# EAGLE design TDA8920+V3.0 (EAGLE 7.5.0)

## Sheet 1 of 4
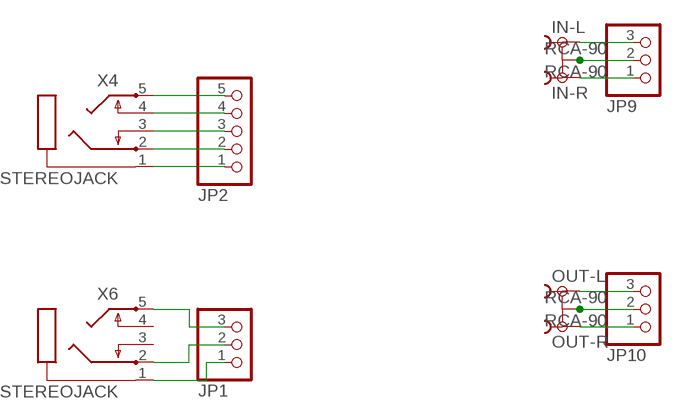
[diagram p0: schematic, sheet 1]

### Parts
IN-L  RCA-90  [RCA-90]
IN-R  RCA-90  [RCA-90]
JP1  PINHD-1X3/90  [1X03/90]
JP2  PINHD-1X5/90  [1X05/90]
JP9  PINHD-1X3  [1X03]
JP10  PINHD-1X3  [1X03]
OUT-L  RCA-90  [RCA-90]
OUT-R  RCA-90  [RCA-90]
X4  STEREOJACK  [STX3100]
X6  STEREOJACK  [STX3100]

### Nets
N$10: JP2.1 X4.1
N$28: JP2.2 X4.2
N$33: JP2.3 X4.3
N$34: JP2.4 X4.4
N$35: JP2.5 X4.5
N$36: JP1.1 X6.1
N$37: JP1.2 X6.2
N$38: JP1.3 X6.5
N$44: IN-L.1 JP9.3
N$45: IN-R.1 JP9.1
N$50: IN-L.2 IN-L.2@1 IN-L.2@2 IN-R.2 IN-R.2@1 IN-R.2@2 JP9.2
N$51: JP10.2 OUT-L.2 OUT-L.2@1 OUT-L.2@2 OUT-R.2 OUT-R.2@1 OUT-R.2@2
N$52: JP10.1 OUT-R.1
N$53: JP10.3 OUT-L.1
Unconnected: X6.3 X6.4

## Sheet 2 of 4
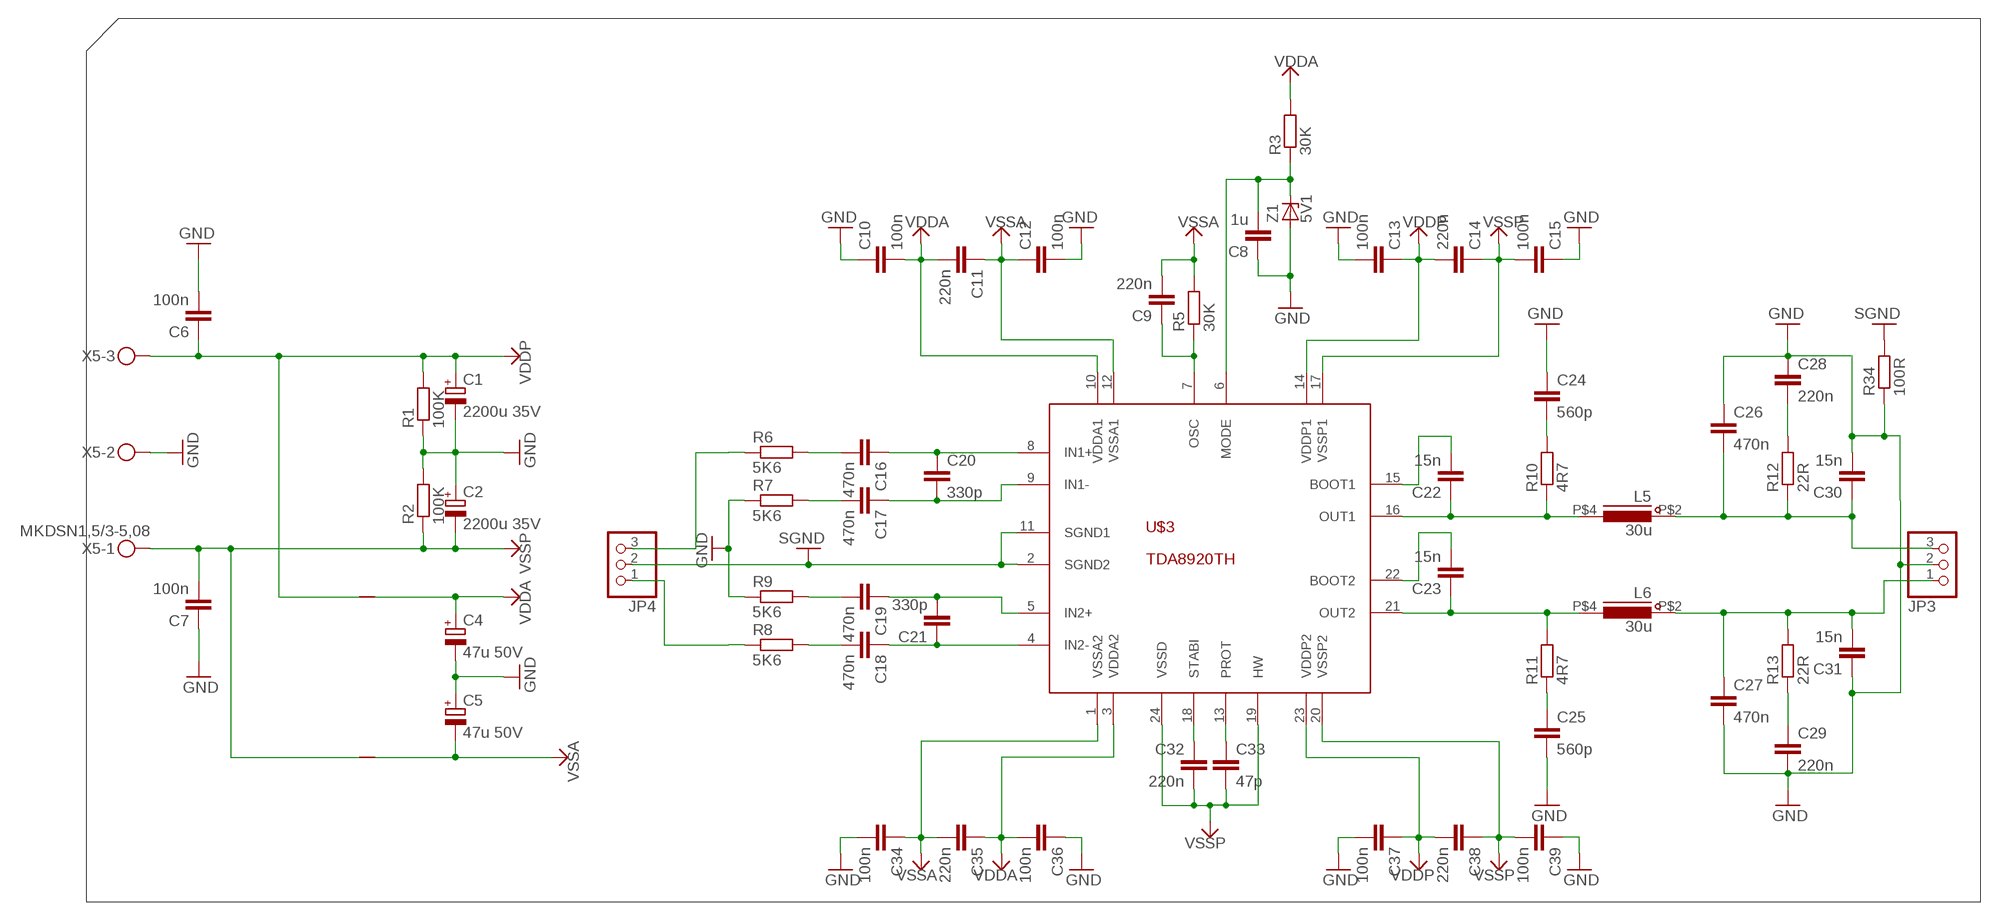
[diagram p1: schematic, sheet 2]

### Parts
C1  2200u 35V  CPOL-EUE7.5-16  [E7,5-16]
C2  2200u 35V  CPOL-EUE7.5-16  [E7,5-16]
C4  47u 50V  CPOL-EUE2.5-6  [E2,5-6]
C5  47u 50V  CPOL-EUE2.5-6  [E2,5-6]
C6  100n  C-EUC1206  [C1206]
C7  100n  C-EUC1206  [C1206]
C8  1u  C-EUC1206  [C1206]
C9  220n  C-EUC0805  [C0805]
C10  100n  C-EUC1206  [C1206]
C11  220n  C-EUC0805  [C0805]
C12  100n  C-EUC1206  [C1206]
C13  100n  C-EUC1206  [C1206]
C14  220n  C-EUC0805  [C0805]
C15  100n  C-EUC1206  [C1206]
C16  470n  C-EUC1206  [C1206]
C17  470n  C-EUC1206  [C1206]
C18  470n  C-EUC1206  [C1206]
C19  470n  C-EUC1206  [C1206]
C20  330p  C-EUC1206  [C1206]
C21  330p  C-EUC1206  [C1206]
C22  15n  C-EUC0805  [C0805]
C23  15n  C-EUC0805  [C0805]
C24  560p  C-EUC0805  [C0805]
C25  560p  C-EUC0805  [C0805]
C26  470n  C-EUC1206  [C1206]
C27  470n  C-EUC1206  [C1206]
C28  220n  C-EUC0805  [C0805]
C29  220n  C-EUC0805  [C0805]
C30  15n  C-EUC0805  [C0805]
C31  15n  C-EUC0805  [C0805]
C32  220n  C-EUC0805  [C0805]
C33  47p  C-EUC0805  [C0805]
C34  100n  C-EUC1206  [C1206]
C35  220n  C-EUC0805  [C0805]
C36  100n  C-EUC1206  [C1206]
C37  100n  C-EUC1206  [C1206]
C38  220n  C-EUC0805  [C0805]
C39  100n  C-EUC1206  [C1206]
JP3  PINHD-1X3  [1X03]
JP4  PINHD-1X3  [1X03]
L5  30u  INDUCTOR-25-25  [INDUCTOR_25-25]
L6  30u  INDUCTOR-25-25  [INDUCTOR_25-25]
R1  100K  R-EU_R1206  [R1206]
R2  100K  R-EU_R1206  [R1206]
R3  30K  R-EU_R0805  [R0805]
R5  30K  R-EU_R0805  [R0805]
R6  5K6  R-EU_R0805  [R0805]
R7  5K6  R-EU_R0805  [R0805]
R8  5K6  R-EU_R0805  [R0805]
R9  5K6  R-EU_R0805  [R0805]
R10  4R7  R-EU_R1206  [R1206]
R11  4R7  R-EU_R1206  [R1206]
R12  22R  R-EU_R2512  [R2512]
R13  22R  R-EU_R2512  [R2512]
R34  100R  R-EU_R1206  [R1206]
U$1  SHORT  [SHORT]
U$2  SHORT  [SHORT]
U$3  TDA8920THCLEAR  [HSOP24]
X5  MKDSN1,5/3-5,08  [MKDSN1,5/3-5,08]
Z1  5V1  ZENER-DIODESOD80C  [SOD80C]

### Nets
GND: C1.- C2.+ C4.- C5.+ C6.2 C7.1 C8.1 C10.1 C12.2 C13.2 C15.1 C24.1 C25.2 C26.1 C27.2 C28.1 C29.2 C30.2 C31.1 C34.2 C36.1 C37.2 C39.1 JP3.2 R1.1 R2.2 R7.1 R9.1 R34.1 X5.2 Z1.A
N$2: C18.2 R8.2
N$3: C18.1 C21.1 U$3.4(IN2-)
N$5: C19.2 R9.2
N$6: C19.1 C21.2 U$3.5(IN2+)
N$8: C16.2 R6.2
N$9: C16.1 C20.1 U$3.8(IN1+)
N$11: C17.2 R7.2
N$12: C17.1 C20.2 U$3.9(IN1-)
N$13: C22.2 U$3.15(BOOT1)
N$14: C32.1 U$3.18(STABI)
N$15: C33.1 U$3.13(PROT)
N$16: C23.2 U$3.22(BOOT2)
N$17: C9.1 R5.1 U$3.7(OSC)
N$18: C23.1 L6.P$4 R11.2 U$3.21(OUT2)
N$19: C22.1 L5.P$4 R10.1 U$3.16(OUT1)
N$20: C25.1 R11.1
N$21: C24.2 R10.2
N$23: C28.2 R12.2
N$26: C27.1 C31.2 JP3.1 L6.P$2 R13.2
N$27: C29.1 R13.1
N$29: C8.2 R3.1 U$3.6(MODE) Z1.C
N$32: JP4.3 R6.1
N$40: C26.2 C30.1 JP3.3 L5.P$2 R12.1
RIGHT_AMP: JP4.1 R8.1
SGND: JP4.2 R34.2 U$3.2(SGND2) U$3.11(SGND1)
VDDA: C4.+ C10.2 C11.2 C35.1 C36.2 R3.2 U$2.P$2 U$3.3(VDDA2) U$3.10(VDDA1)
VDDP: C1.+ C6.1 C13.1 C14.2 C37.1 C38.2 R1.2 U$2.P$1 U$3.14(VDDP1) U$3.23(VDDP2) X5.3
VSSA: C5.- C9.2 C11.1 C12.1 C34.1 C35.2 R5.2 U$1.P$2 U$3.1(VSSA2) U$3.12(VSSA1)
VSSP: C2.- C7.2 C14.1 C15.2 C32.2 C33.2 C38.1 C39.2 R2.1 U$1.P$1 U$3.17(VSSP1) U$3.19(HW) U$3.20(VSSP2) U$3.24(VSSD) X5.1

## Sheet 3 of 4
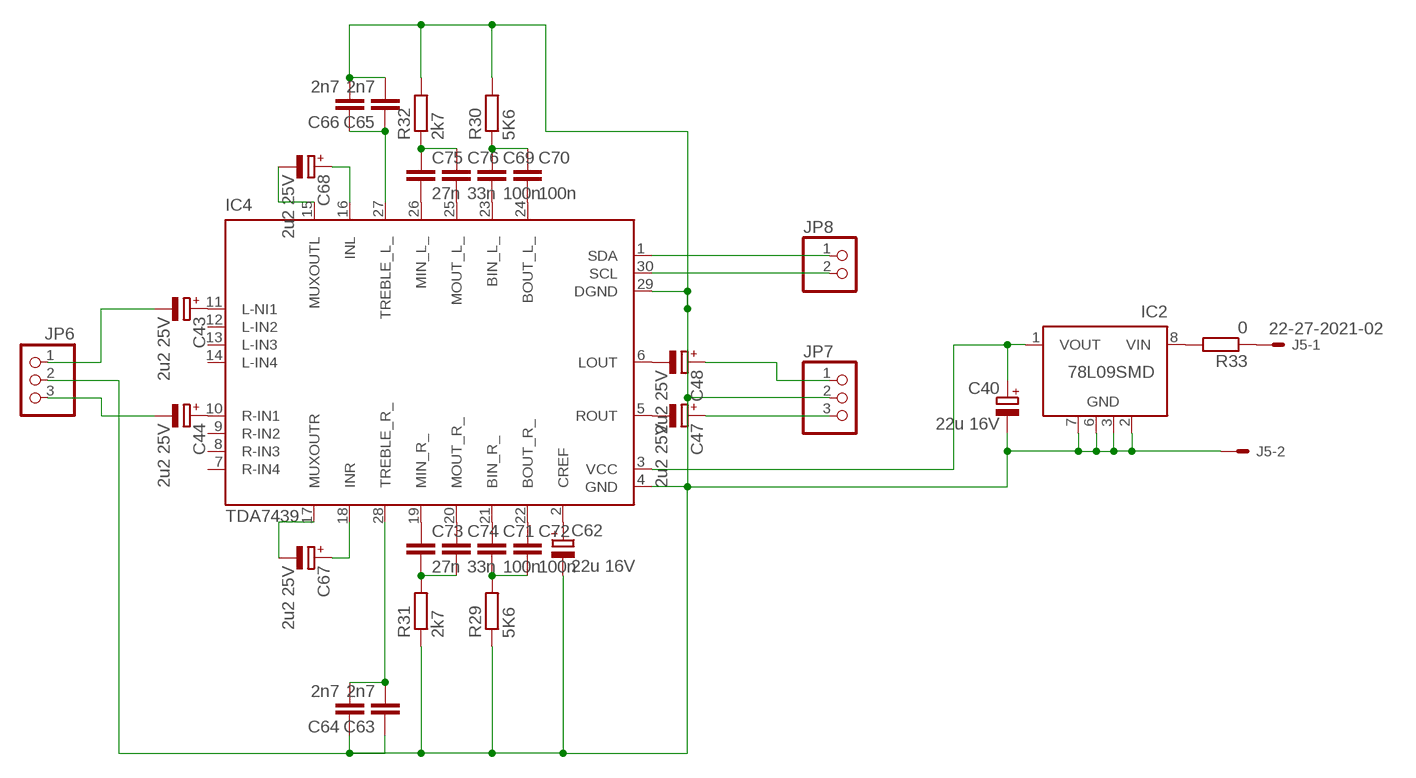
[diagram p2: schematic, sheet 3]

### Parts
C40  22u 16V  CPOL-EUSMCB  [SMC_B]
C43  2u2 25V  CPOL-EUSMCA  [SMC_A]
C44  2u2 25V  CPOL-EUSMCA  [SMC_A]
C47  2u2 25V  CPOL-EUSMCA  [SMC_A]
C48  2u2 25V  CPOL-EUSMCA  [SMC_A]
C62  22u 16V  CPOL-EUSMCB  [SMC_B]
C63  2n7  C-EUC0805  [C0805]
C64  2n7  C-EUC0805  [C0805]
C65  2n7  C-EUC0805  [C0805]
C66  2n7  C-EUC0805  [C0805]
C67  2u2 25V  CPOL-EUSMCA  [SMC_A]
C68  2u2 25V  CPOL-EUSMCA  [SMC_A]
C69  100n  C-EUC0805  [C0805]
C70  100n  C-EUC0805  [C0805]
C71  100n  C-EUC0805  [C0805]
C72  100n  C-EUC0805  [C0805]
C73  27n  C-EUC0805  [C0805]
C74  33n  C-EUC0805  [C0805]
C75  27n  C-EUC0805  [C0805]
C76  33n  C-EUC0805  [C0805]
IC2  78L09SMD  78L05SMD  [SO08]
IC4  TDA7439  [SDIP30]
J5  22-27-2021-02  [6410-02]
JP6  PINHD-1X3  [1X03]
JP7  PINHD-1X3  [1X03]
JP8  PINHD-1X2  [1X02]
R29  5K6  R-EU_R0805  [R0805]
R30  5K6  R-EU_R0805  [R0805]
R31  2k7  R-EU_R1206  [R1206]
R32  2k7  R-EU_R1206  [R1206]
R33  0  R-EU_R1206  [R1206]

### Nets
CREF: C62.+ IC4.2(CREF)
N$1: C43.+ IC4.11(L-NI1)
N$4: C44.+ IC4.10(R-IN1)
N$22: C43.- JP6.1
N$31: C44.- JP6.3
N$39: C48.+ JP7.1
N$41: C47.+ JP7.3
N$42: C48.- IC4.6(LOUT)
N$43: C47.- IC4.5(ROUT)
N$46: IC4.30(SCL) JP8.2
N$47: IC4.1(SDA) JP8.1
N$48: C40.+ IC2.1(VOUT) IC4.3(VCC)
N$49: IC2.8(VIN) R33.2
N$69: J5.1 R33.1
N$90: C65.1 C66.1 IC4.27(TREBLE_L_)
N$92: C63.2 C64.2 IC4.28(TREBLE_R_)
N$93: C68.+ IC4.16(INL)
N$94: C68.- IC4.15(MUXOUTL)
N$95: C67.+ IC4.18(INR)
N$96: C67.- IC4.17(MUXOUTR)
N$97: C69.2 IC4.23(BIN_L_)
N$98: C70.2 IC4.24(BOUT_L_)
N$99: C71.1 IC4.21(BIN_R_)
N$100: C72.1 IC4.22(BOUT_R_)
N$101: C71.2 C72.2 R29.2
N$102: C69.1 C70.1 R30.1
N$103: C73.1 IC4.19(MIN_R_)
N$104: C74.1 IC4.20(MOUT_R_)
N$105: C75.2 IC4.26(MIN_L_)
N$106: C76.2 IC4.25(MOUT_L_)
N$107: C73.2 C74.2 R31.2
N$108: C75.1 C76.1 R32.1
TDA_DGND: C40.- C62.- C63.1 C64.1 C65.2 C66.2 IC2.2(GND) IC2.3(GND) IC2.6(GND) IC2.7(GND) IC4.4(GND) IC4.29(DGND) J5.2 JP6.2 JP7.2 R29.1 R30.2 R31.1 R32.2
Unconnected: IC2.4(NC) IC2.5(NC) IC4.7(R-IN4) IC4.8(R-IN3) IC4.9(R-IN2) IC4.12(L-IN2) IC4.13(L-IN3) IC4.14(L-IN4)

## Sheet 4 of 4
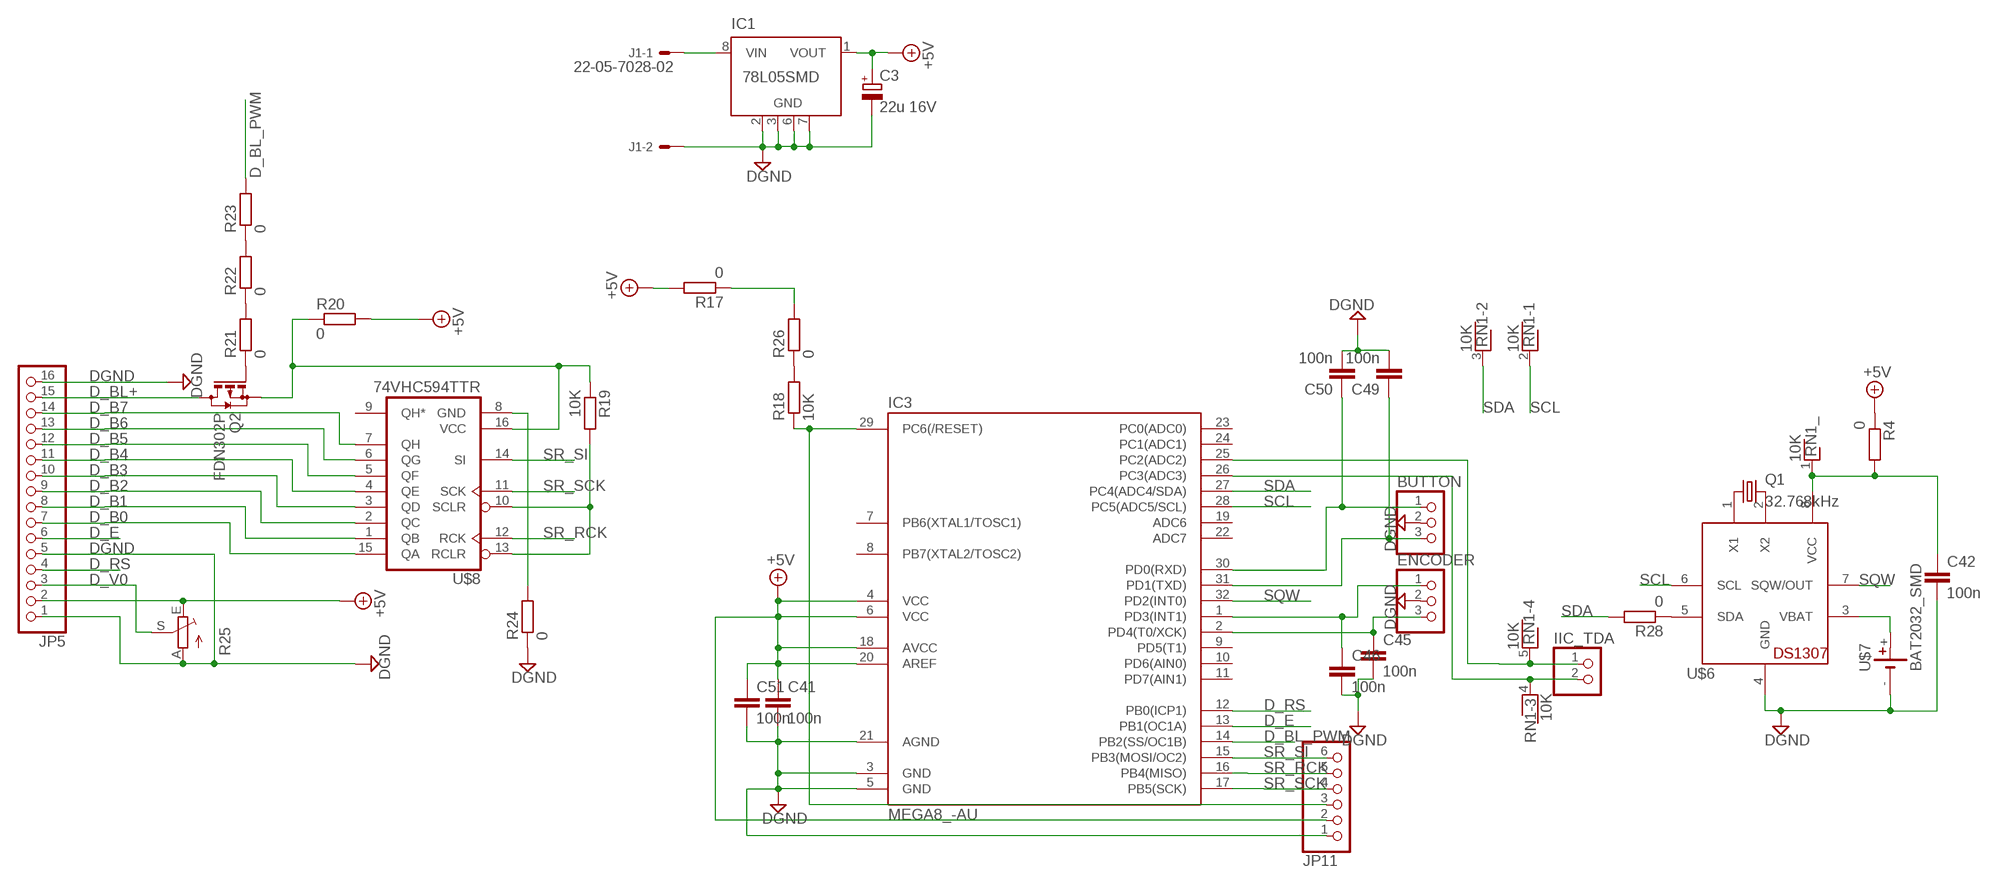
[diagram p3: schematic, sheet 4]

### Parts
BUTTON  PINHD-1X3  [1X03]
C3  22u 16V  CPOL-EUSMCB  [SMC_B]
C41  100n  C-EUC0805  [C0805]
C42  100n  C-EUC0805  [C0805]
C45  100n  C-EUC1206  [C1206]
C46  100n  C-EUC1206  [C1206]
C49  100n  C-EUC1206  [C1206]
C50  100n  C-EUC1206  [C1206]
C51  100n  C-EUC0805  [C0805]
ENCODER  PINHD-1X3  [1X03]
IC1  78L05SMD  [SO08]
IC3  MEGA8_-AU  [TQFP32-08]
IIC_TDA  PINHD-1X2  [1X02]
J1  22-05-7028-02  [7395-02]
JP5  PINHD-1X16  [1X16]
JP11  PINHD-1X6  [1X06]
Q1  32.768kHz  CRYSTALMM20SS  [MM20SS]
Q2  FDN302P  BSS84  [SOT23]
R4  0  R-EU_R1206  [R1206]
R17  0  R-EU_R1206  [R1206]
R18  10K  R-EU_R1206  [R1206]
R19  10K  R-EU_R1206  [R1206]
R20  0  R-EU_R1206  [R1206]
R21  0  R-EU_R1206  [R1206]
R22  0  R-EU_R1206  [R1206]
R23  0  R-EU_R1206  [R1206]
R24  0  R-EU_R1206  [R1206]
R25  TRIM_EU-S75H  [S75H]
R26  0  R-EU_R1206  [R1206]
R28  0  R-EU_R1206  [R1206]
RN1  10K  RNX4  [RN-5]
U$6  DS1307  [SO8]
U$7  BAT2032_SMD  [BAT2032_SMD]
U$8  74VHC594TTR  [TSSOP16]

### Nets
+5V: C3.+ C41.1 C51.1 IC1.1(VOUT) IC3.4(VCC) IC3.6(VCC) IC3.18(AVCC) IC3.20(AREF) JP5.2 JP11.2 R4.1 R17.2 R20.2 R25.E
D_B0: JP5.7 U$8.15(QA)
D_B1: JP5.8 U$8.1(QB)
D_B2: JP5.9 U$8.2(QC)
D_B3: JP5.10 U$8.3(QD)
D_B4: JP5.11 U$8.4(QE)
D_B5: JP5.12 U$8.5(QF)
D_B6: JP5.13 U$8.6(QG)
D_B7: JP5.14 U$8.7(QH)
D_BL+: JP5.15 Q2.3(D)
D_BL_PWM: IC3.14(PB2(SS/OC1B)) R23.2
D_E: IC3.13(PB1(OC1A)) JP5.6
D_RS: IC3.12(PB0(ICP1)) JP5.4
D_V0: JP5.3 R25.S
DGND: BUTTON.2 C3.- C41.2 C42.2 C45.2 C46.2 C49.2 C50.2 C51.2 ENCODER.2 IC1.2(GND) IC1.3(GND) IC1.6(GND) IC1.7(GND) IC3.3(GND) IC3.5(GND) IC3.21(AGND) J1.2 JP5.1 JP5.5 JP5.16 JP11.1 R24.1 R25.A U$6.4(GND) U$7.-
MEGA_RESET: IC3.29(PC6(/RESET)) JP11.3 R18.1
N$7: IC1.8(VIN) J1.1
N$24: Q1.4 U$6.2(X2)
N$25: Q1.1 U$6.1(X1)
N$30: U$6.3(VBAT) U$7.+
N$54: R19.2 U$8.10(SCLR) U$8.13(RCLR)
N$55: Q2.2(S) R19.1 R20.1 U$8.16(VCC)
N$57: Q2.1(G) R21.1
N$58: R21.2 R22.1
N$59: R22.2 R23.1
N$60: R24.2 U$8.8(GND)
N$61: R18.2 R26.1
N$62: R17.1 R26.2
N$64: R28.1 U$6.5(SDA)
N$65: C42.1 R4.2 RN1.1 U$6.8(VCC)
N$66: C46.1 ENCODER.1 IC3.1(PD3(INT1))
N$67: C45.1 ENCODER.3 IC3.2(PD4(T0/XCK))
N$68: BUTTON.1 C50.1 IC3.30(PD0(RXD))
N$71: BUTTON.3 C49.1 IC3.31(PD1(TXD))
SCL: IC3.28(PC5(ADC5/SCL)) RN1.2 U$6.6(SCL)
SCL_TDA: IC3.26(PC3(ADC3)) IIC_TDA.2 RN1.4
SDA: IC3.27(PC4(ADC4/SDA)) R28.2 RN1.3
SDA_TDA: IC3.25(PC2(ADC2)) IIC_TDA.1 RN1.5
SQW: IC3.32(PD2(INT0)) U$6.7(SQW/OUT)
SR_RCK: IC3.16(PB4(MISO)) JP11.5 U$8.12(RCK)
SR_SCK: IC3.17(PB5(SCK)) JP11.4 U$8.11(SCK)
SR_SI: IC3.15(PB3(MOSI/OC2)) JP11.6 U$8.14(SI)
Unconnected: IC1.4(NC) IC1.5(NC) IC3.7(PB6(XTAL1/TOSC1)) IC3.8(PB7(XTAL2/TOSC2)) IC3.9(PD5(T1)) IC3.10(PD6(AIN0)) IC3.11(PD7(AIN1)) IC3.19(ADC6) IC3.22(ADC7) IC3.23(PC0(ADC0)) IC3.24(PC1(ADC1)) U$8.9(QH*)

## Library data of the parts
BUTTON ENCODER JP1 JP3 JP4 JP6 JP7 JP9 JP10 = pinhead:PINHD-1X3: PIN HEADER
C1-C5 C40 C43 C44 C47 C48 C62 C67 C68 = rcl:CPOL-EU: POLARIZED CAPACITOR, European symbol
C6-C39 C41 C42 C45 C46 C49-C51 C63-C66 C69-C76 = rcl:C-EU: CAPACITOR, European symbol
IC1 IC2 = linear:78L*SMD: Positive VOLTAGE REGULATOR
IC3 = avr-7:MEGA8_
IC4 = Namenlos:TDA7439: edit this description Auto generated by make-symbol-device-package-bsdl.ulp Rev. 44 Source:
IIC_TDA JP8 = pinhead:PINHD-1X2: PIN HEADER
IN-L IN-R OUT-L OUT-R = Namenlos:RCA-90
J1 = con-molex:22-?-02: CONNECTOR wire to board 2.54 mm (.1 inch) pitch header; OC_FARNELL: 9731601; OC_NEWARK: unknown
J5 = con-molex:22-?-02: CONNECTOR wire to board 2.54 mm (.1 inch) pitch header; OC_FARNELL: unknown; OC_NEWARK: unknown
JP2 = pinhead:PINHD-1X5: PIN HEADER
JP5 = pinhead:PINHD-1X16: PIN HEADER
JP11 = pinhead:PINHD-1X6: PIN HEADER
L5 L6 = _Transformers:INDUCTOR-25-25
Q1 = crystal:CRYSTAL: CRYSTAL; OC_FARNELL: unknown; OC_NEWARK: unknown
Q2 = transistor-small-signal:BSS84: P-CHANNEL MOS FET
R1-R13 R17-R24 R26 R28-R34 = rcl:R-EU_: RESISTOR, European symbol
R25 = pot:TRIM_EU-: POTENTIOMETER
RN1 = resistor-net:RNX4: RESISTOR NETWORK; OC_FARNELL: unknown; OC_NEWARK: unknown
U$1 U$2 = Namenlos:SHORT
U$3 = Namenlos:TDA8920TH
U$6 = Namenlos:DS1307
U$7 = Namenlos:BAT2032_SMD
U$8 = Namenlos:74VHC594TTR
X4 X6 = Namenlos at:STEREOJACK: MIC/HEADPHONE JACK Stereo jack with two switches. Kycon STX3100, CUI SJ1-3555NG and/or 4UCon 05544
X5 = con-phoenix-508:MKDSN1,5/3-5,08: MKDSN 1,5/ 3-5,08 Printklemme Nennstrom: 13,5 A Nennspannung: 250 V Rastermaß: 5,08 mm Polzahl: 3 Anschlussart: Schraubanschluss Montage: Löten Anschlussrichtung Leiter/Platine: 0 ° Artikelnummer: 1729131 Source: http://eshop.phoenixcontact.com .. 1729131.pdf
Z1 = diode:ZENER-DIODE: Z-Diode

## Net classes
0 default: width 0.254 mm

## Board
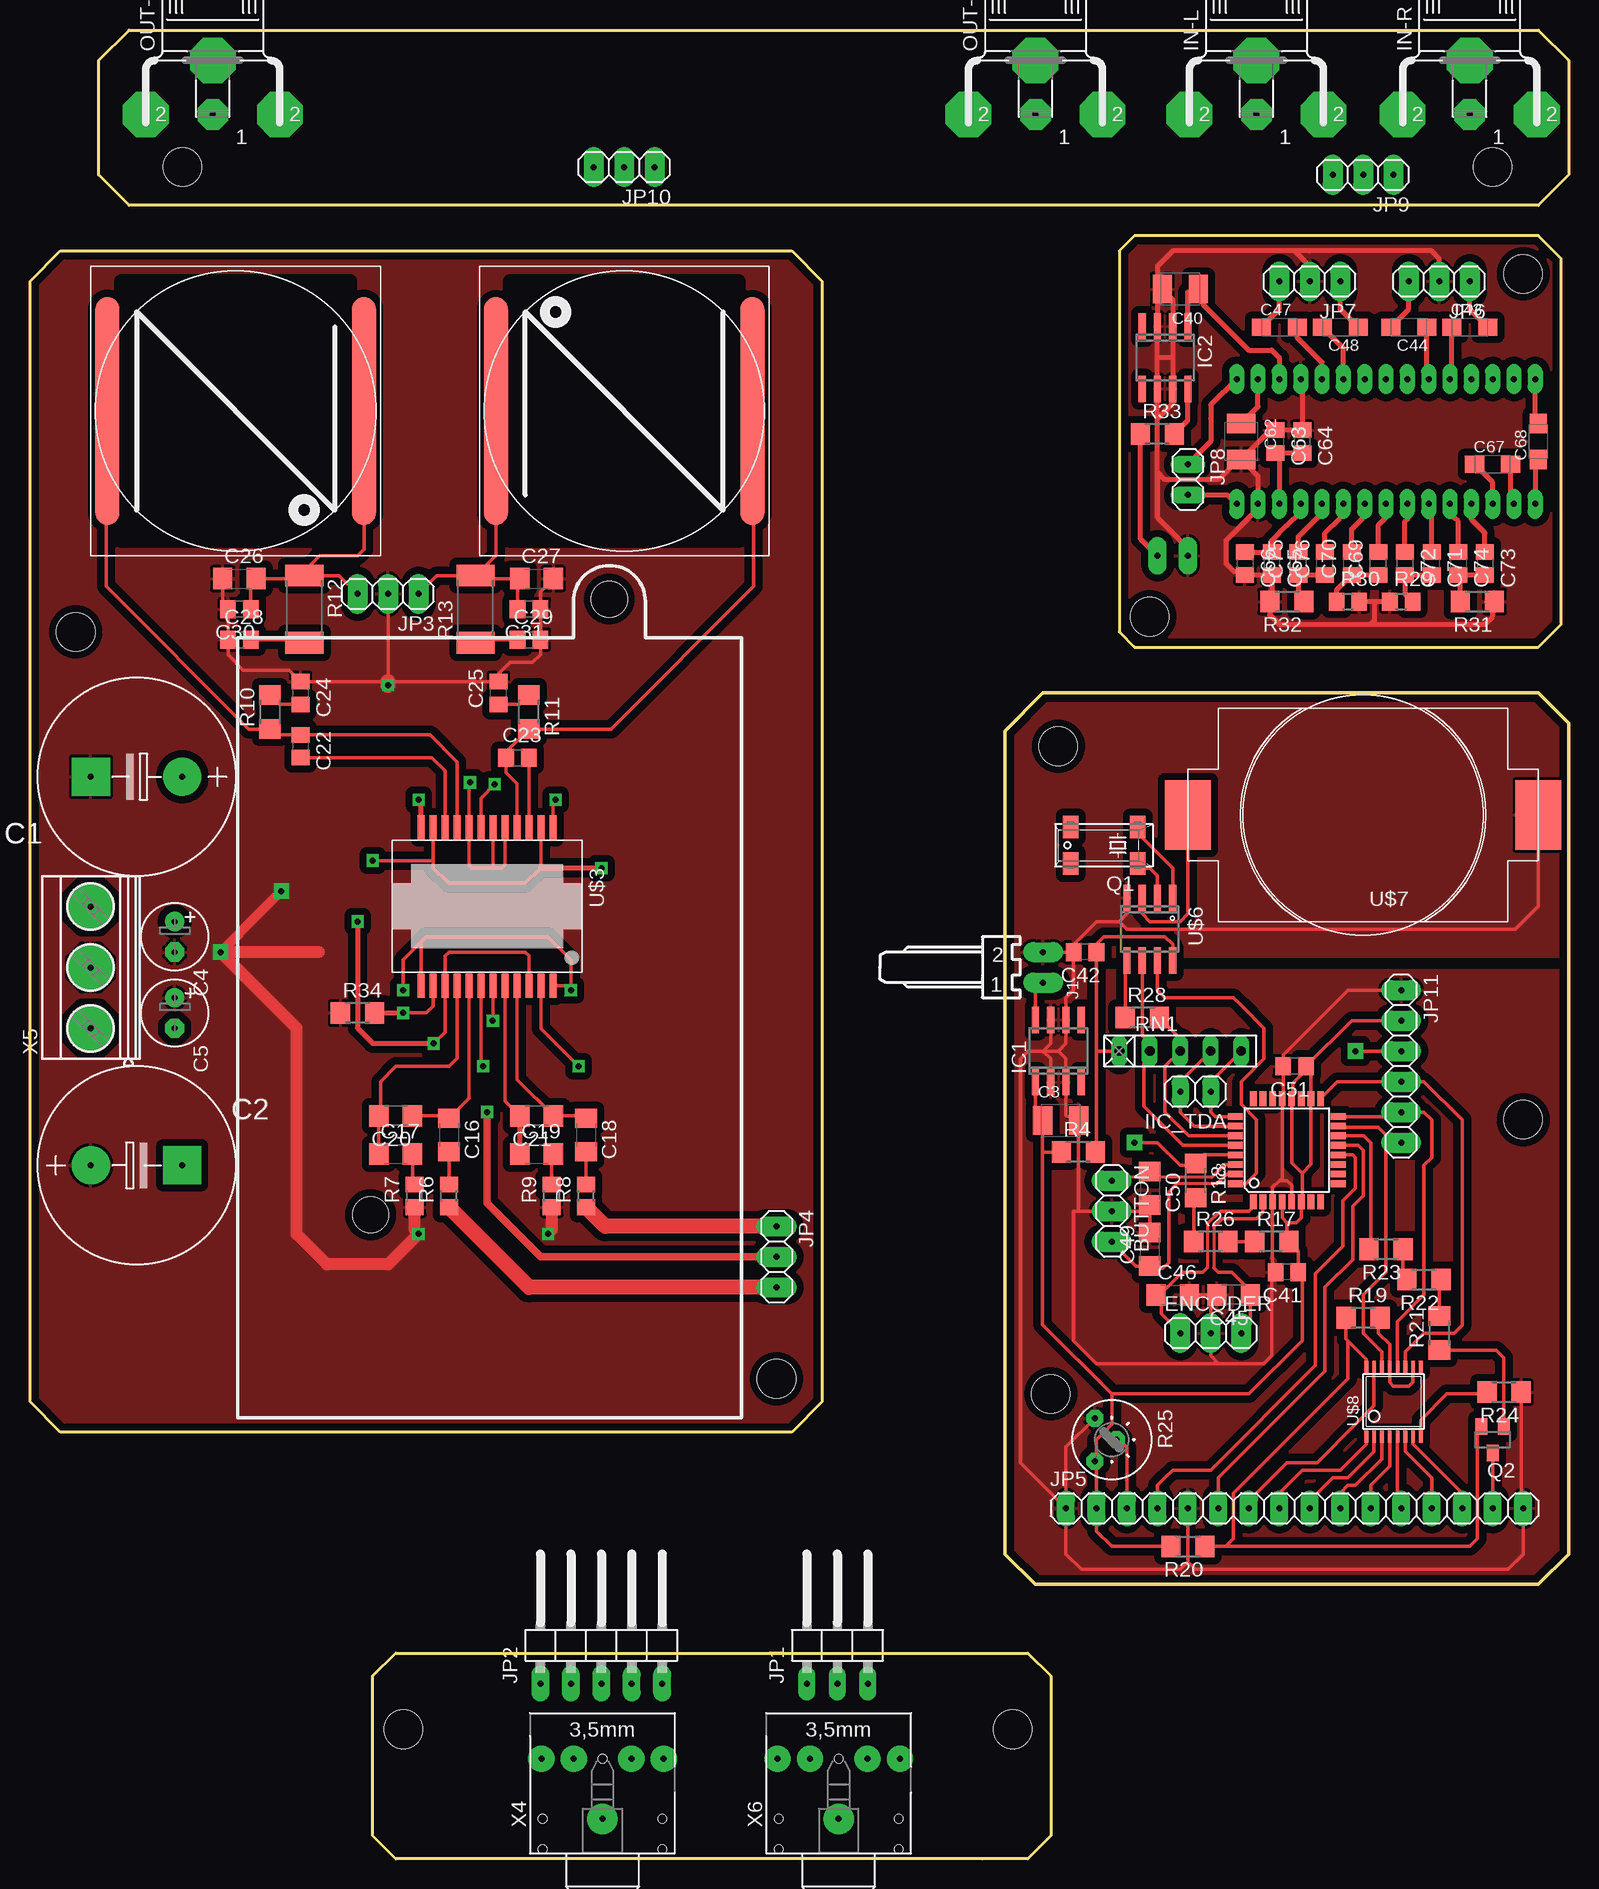
[diagram p4: board, top side]
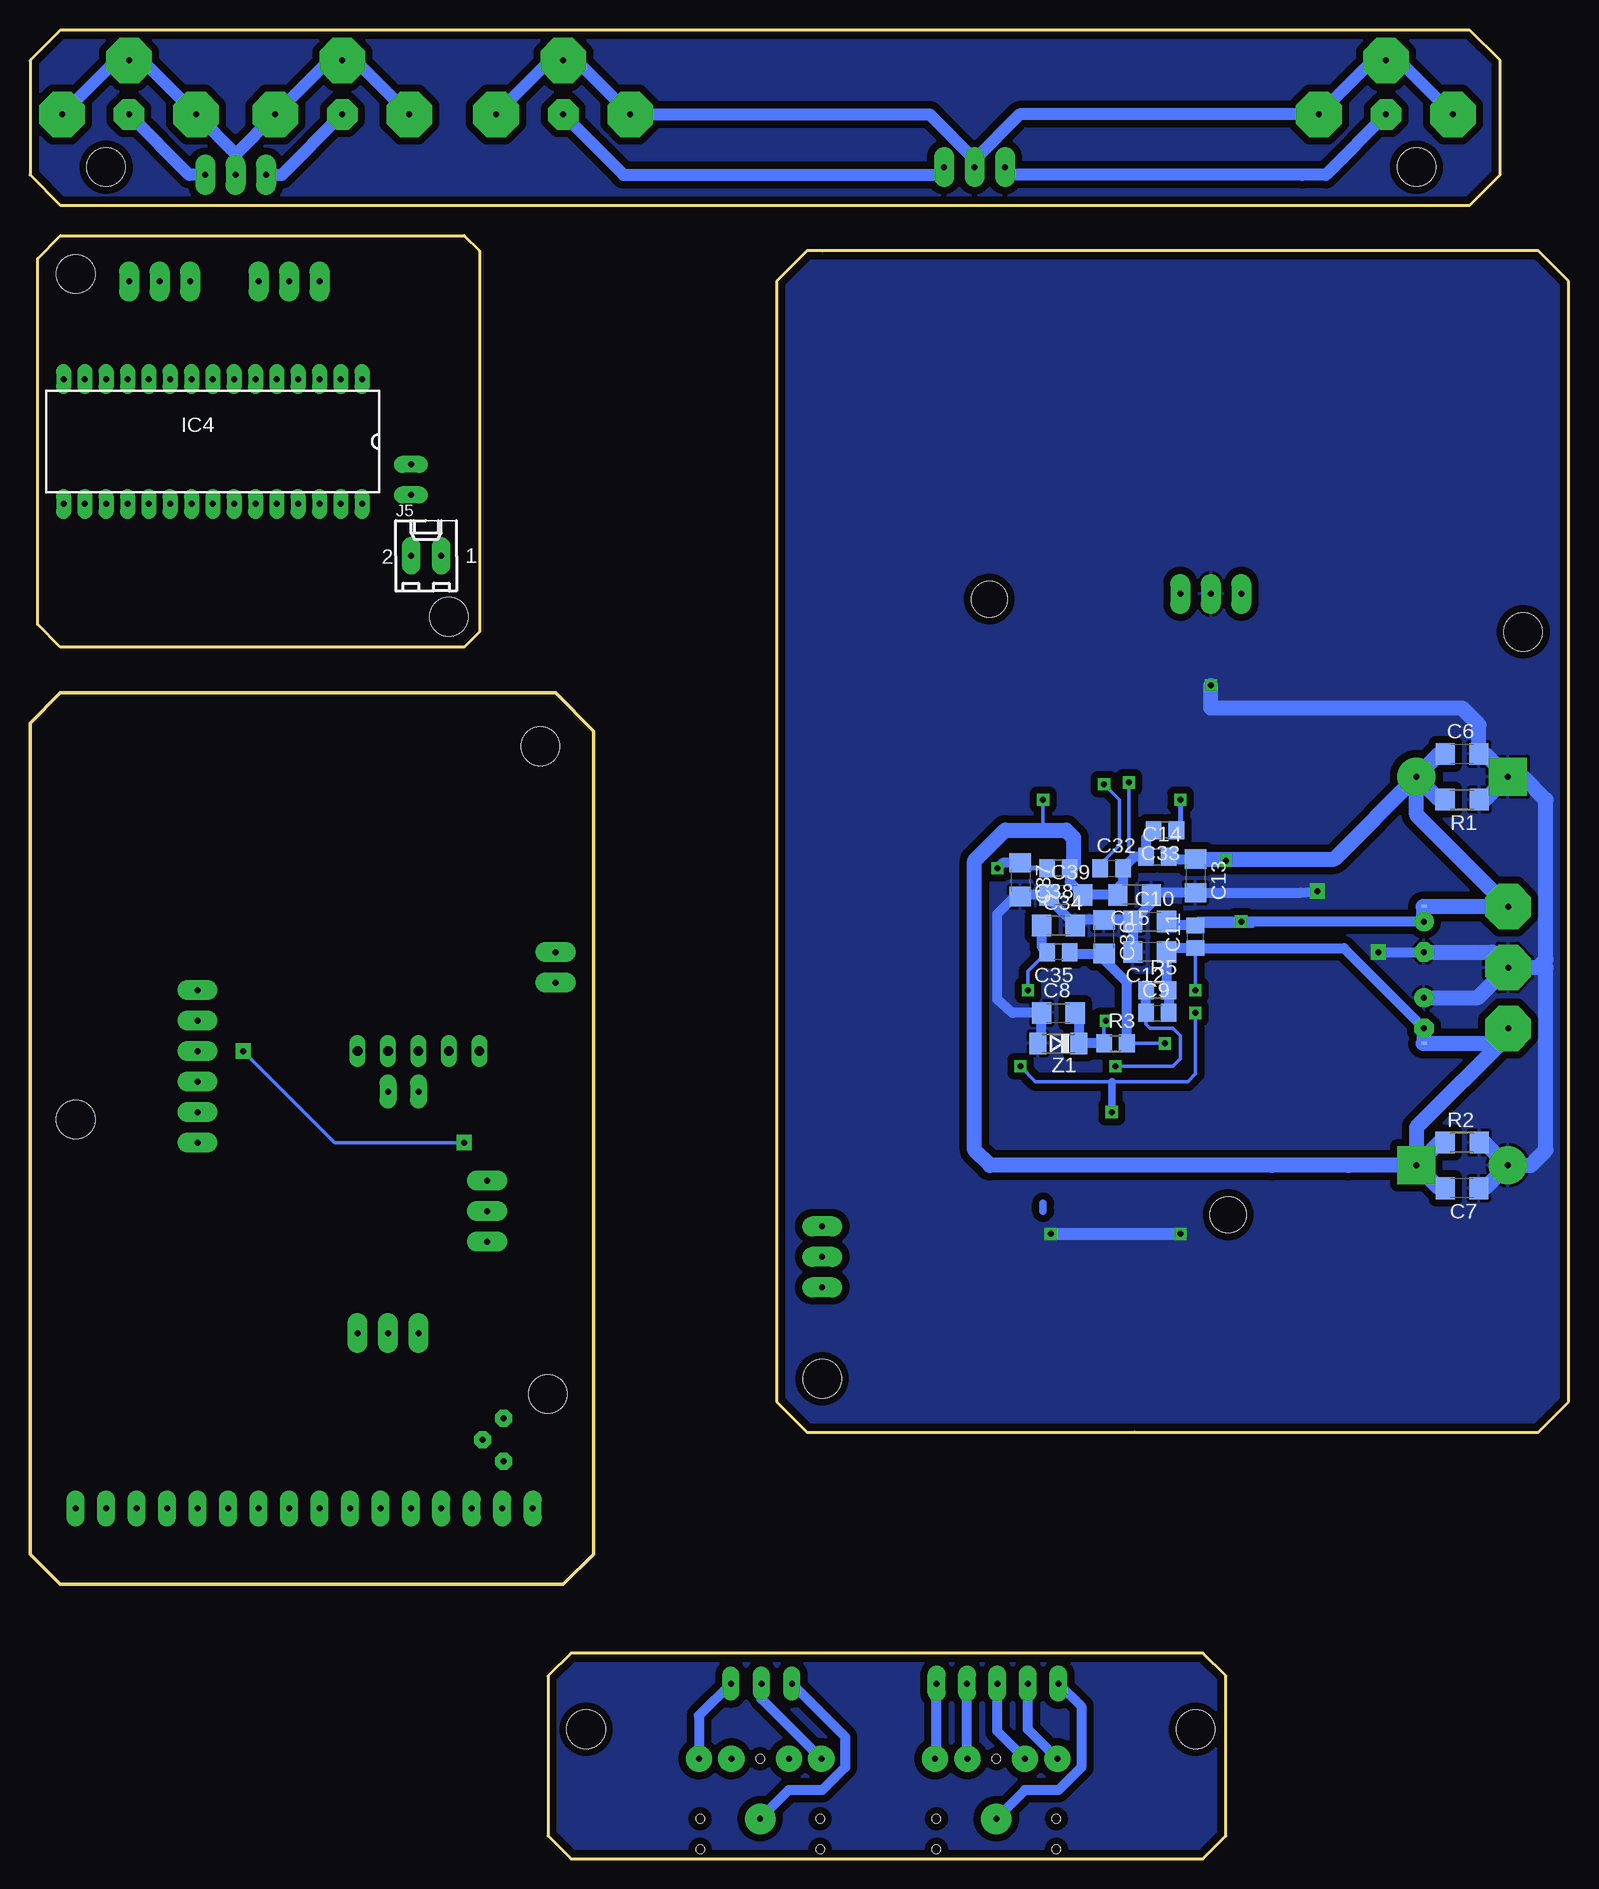
[diagram p5: board, bottom side, seen from below]

Size 128.27 x 152.4 mm. Coordinates in mm from the lower left corner, seen from the top.
Outline: 66.04,73.02 66.04,38.1 63.5,35.56 36.2,35.56 2.54,35.56 0,38.1 0,122.56 0,131.44 2.54,133.98 62.23,133.98 63.5,133.98 66.04,131.44 66.04,73.02
Outline: 128.27,25.4 128.27,94.62 125.73,97.16 84.45,97.16 81.28,93.98 81.28,25.4 83.82,22.86 125.73,22.86 128.27,25.4
Outline: 90.8,133.98 90.8,102.23 92.08,100.97 125.73,100.97 127.64,102.87 127.64,133.35 125.73,135.25 92.08,135.25 90.8,133.98
Outline: 5.71,149.86 8.25,152.4 125.73,152.4 128.27,149.86 128.27,140.34 125.73,137.79 8.25,137.79 5.71,140.34 5.71,149.86
Outline: 79.38,0 30.48,0 28.57,1.91 28.57,15.24 30.48,17.14 83.19,17.14 85.09,15.24 85.09,1.91 83.19,0 79.38,0
Copper layers (1*16): Top 0.035mm / dielectric 1.5mm / Bottom 0.035mm
Design rules "default *": minimum track width 8mil, minimum drill 0.5mm, track to track 8mil, track to pad 8mil, pad to pad 8mil, via to via 8mil, smd to smd 8mil, copper to edge 16mil, drill to drill 8mil, minimum pad ring 10mil, minimum via ring 8mil, stop-mask expansion 4mil, vias tented up to drill 0mil, thermal gap 10mil
Holes 3.2 mm at 31.11,10.79 81.91,10.79 12.7,140.97 121.92,140.97 3.81,102.23 62.23,40 85.09,38.73 124.46,61.59 85.72,92.71 93.34,103.5 124.46,132.08

### Footprints (pad centres in the part's own frame; a part is rotated, then mirrored left to right if it is on the bottom)
1X03 = drill 0.5 pad 1.676 long: 1 -2.54,0; 2 0,0; 3 2.54,0
E7,5-16 = drill 0.5 pad 3.175: + -3.81,0 | drill 0.5 pad 3.175 square: - 3.81,0
SMC_B = smd 1.6 x 2.4: + -1.5,0; - 1.5,0
E2,5-6 = drill 0.5 pad 1.6: + -1.27,0 | drill 0.5 pad 1.6 octagon: - 1.27,0
C1206 = smd 1.6 x 1.8: 1 -1.4,0; 2 1.4,0
C0805 = smd 1.3 x 1.5: 1 -0.95,0; 2 0.95,0
SMC_A = smd 1.6 x 1.4: + -1.5,0; - 1.5,0
SO08 = smd 0.6 x 2.2: 1 -1.905,-2.6; 2 -0.635,-2.6; 3 0.635,-2.6; 4 1.905,-2.6; 5 1.905,2.6; 6 0.635,2.6; 7 -0.635,2.6; 8 -1.905,2.6
TQFP32-08 = smd 1.27 x 0.559: 1 -4.293,2.8; 2 -4.293,2; 3 -4.293,1.2; 4 -4.293,0.4; 5 -4.293,-0.4; 6 -4.293,-1.2; 7 -4.293,-2; 8 -4.293,-2.8; 17 4.293,-2.8; 18 4.293,-2; 19 4.293,-1.2; 20 4.293,-0.4; 21 4.293,0.4; 22 4.293,1.2; 23 4.293,2; 24 4.293,2.8 | smd 0.559 x 1.27: 9 -2.8,-4.293; 10 -2,-4.293; 11 -1.2,-4.293; 12 -0.4,-4.293; 13 0.4,-4.293; 14 1.2,-4.293; 15 2,-4.293; 16 2.8,-4.293; 25 2.8,4.293; 26 2,4.293; 27 1.2,4.293; 28 0.4,4.293; 29 -0.4,4.293; 30 -1.2,4.293; 31 -2,4.293; 32 -2.8,4.293
SDIP30 = drill 0.5 pad 1.27 long: 1 -5.2,12.446; 2 -5.2,10.668; 3 -5.2,8.89; 4 -5.2,7.112; 5 -5.2,5.334; 6 -5.2,3.556; 7 -5.2,1.778; 8 -5.2,0; 9 -5.2,-1.778; 10 -5.2,-3.556; 11 -5.2,-5.334; 12 -5.2,-7.112; 13 -5.2,-8.89; 14 -5.2,-10.668; 15 -5.2,-12.446; 16 5.2,-12.446; 17 5.2,-10.668; 18 5.2,-8.89; 19 5.2,-7.112; 20 5.2,-5.334; 21 5.2,-3.556; 22 5.2,-1.778; 23 5.2,0; 24 5.2,1.778; 25 5.2,3.556; 26 5.2,5.334; 27 5.2,7.112; 28 5.2,8.89; 29 5.2,10.668; 30 5.2,12.446
1X02 = drill 0.5 pad 1.422 long: 1 -1.27,0; 2 1.27,0
RCA-90 = drill 0.5 pad 2.54 octagon: 1 0,-4.5 | drill 0.5 pad 3.81 octagon: 2 5.588,-4.5; 2@1 -5.588,-4.5; 2@2 0,0
7395-02 = drill 0.5 pad 1.676 long: 1 1.27,0; 2 -1.27,0
6410-02 = drill 0.5 pad 1.55 long: 1 1.27,0; 2 -1.27,0
1X03/90 = drill 0.5 pad 1.422 long: 1 -2.54,-3.81; 2 0,-3.81; 3 2.54,-3.81
1X05/90 = drill 0.5 pad 1.5 long: 1 -5.08,-3.81; 2 -2.54,-3.81; 3 0,-3.81; 4 2.54,-3.81; 5 5.08,-3.81
1X16 = drill 0.5 pad 1.5 long: 1 -19.05,0; 2 -16.51,0; 3 -13.97,0; 4 -11.43,0; 5 -8.89,0; 6 -6.35,0; 7 -3.81,0; 8 -1.27,0; 9 1.27,0; 10 3.81,0; 11 6.35,0; 12 8.89,0; 13 11.43,0; 14 13.97,0; 15 16.51,0; 16 19.05,0
1X06 = drill 0.5 pad 1.676 long: 1 -6.35,0; 2 -3.81,0; 3 -1.27,0; 4 1.27,0; 5 3.81,0; 6 6.35,0
INDUCTOR_25-25 = smd 2 x 19: P$2 -10.695,-0.002; P$4 10.695,-0.002
MM20SS = smd 1.27 x 1.88: 1 -2.794,-1.524; 2 2.794,-1.524; 3 2.794,1.524; 4 -2.794,1.524
SOT23 = smd 1 x 1.4: 1 -0.95,-1.1; 2 0.95,-1.1; 3 0,1.1
R1206 = smd 1.6 x 1.803: 1 -1.422,0; 2 1.422,0
R0805 = smd 1.3 x 1.5: 1 -0.95,0; 2 0.95,0
R2512 = smd 1.8 x 3.2: 1 -2.8,0; 2 2.8,0
S75H = drill 0.5 pad 1.422 octagon: A -1.778,-1.397; E 1.778,-1.397; S 0,0.381
RN-5 = drill 0.813 long: 1 -5.08,0; 2 -2.54,0; 3 0,0; 4 2.54,0; 5 5.08,0
SHORT = smd 0.305 x 0.254: P$1 -0.064,0; P$2 0.064,0
HSOP24 = smd 0.6 x 2: 1 -5.5,6.6; 2 -4.5,6.6; 3 -3.5,6.6; 4 -2.5,6.6; 5 -1.5,6.6; 6 -0.5,6.6; 7 0.5,6.6; 8 1.5,6.6; 9 2.5,6.6; 10 3.5,6.6; 11 4.5,6.6; 12 5.5,6.6; 13 5.5,-6.6; 14 4.5,-6.6; 15 3.5,-6.6; 16 2.5,-6.6; 17 1.5,-6.6; 18 0.5,-6.6; 19 -0.5,-6.6; 20 -1.5,-6.6; 21 -2.5,-6.6; 22 -3.5,-6.6; 23 -4.5,-6.6; 24 -5.5,-6.6
HEATSINK_65_42 = hole 3: -25.6,10.2; 25.7,-9.7
SO8 = smd 0.6 x 2.2: 1 -1.905,-2.6; 2 -0.635,-2.6; 3 0.635,-2.6; 4 1.905,-2.6; 5 1.905,2.6; 6 0.635,2.6; 7 -0.635,2.6; 8 -1.905,2.6
BAT2032_SMD = smd 3.81 x 5.8: + 14.605,0; - -14.605,0
TSSOP16 = smd 0.305 x 0.991: 1 -2.275,-2.918; 2 -1.625,-2.918; 3 -0.975,-2.918; 4 -0.325,-2.918; 5 0.325,-2.918; 6 0.975,-2.918; 7 1.625,-2.918; 8 2.275,-2.918; 9 2.275,2.918; 10 1.625,2.918; 11 0.975,2.918; 12 0.325,2.918; 13 -0.325,2.918; 14 -0.975,2.918; 15 -1.625,2.918; 16 -2.275,2.918
STX3100 = drill 0.5 pad 2.54: 1 2.7,-0.1 | drill 0.5 pad 2.184: 2 7.7,5; 3 7.7,2.3; 4 7.7,-2.5; 5 7.7,-5.2 | hole 0.7: 2.7,4.9; 2.7,-5.1; 7.7,-0.1; 0.16,-5.1; 0.16,4.9
MKDSN1,5/3-5,08 = drill 0.5 pad 3.81 octagon: 1 -7.641,0.025; 2 -2.561,0.025; 3 2.519,0.025
SOD80C = smd 1.4 x 1.8: A 1.7,0; C -1.7,0

### Placement (x,y rotation side)
BUTTON  90.17,53.97 270 top
C1  8.89,90.17 180 top
C2  8.89,57.78 0 top
C3  85.91,61.52 0 top
C4  12.07,76.83 270 top
C5  12.07,70.48 270 top
C6  8.89,92.08 0 bottom
C7  8.89,55.88 180 bottom
C8  42.55,70.48 0 bottom
C9  34.29,70.48 0 bottom
C10  34.92,78.11 0 bottom
C11  31.11,76.83 90 bottom
C12  34.92,75.56 180 bottom
C13  31.11,81.91 270 bottom
C14  34.29,83.5 0 bottom
C15  36.2,80.33 180 bottom
C16  34.92,60.33 270 top
C17  30.48,58.74 0 top
C18  46.36,60.33 270 top
C19  42.23,58.74 0 top
C20  30.48,61.91 180 top
C21  42.23,61.91 180 top
C22  22.54,92.71 270 top
C23  40.64,91.76 0 top
C24  22.54,97.16 270 top
C25  39.05,97.16 90 top
C26  17.46,106.68 0 top
C27  42.23,106.68 0 top
C28  17.46,101.6 0 top
C29  41.59,101.6 0 top
C30  17.46,104.14 180 top
C31  41.59,104.14 180 top
C32  38.1,82.55 0 bottom
C33  33.66,85.72 180 bottom
C34  42.55,77.79 0 bottom
C35  42.55,75.56 180 bottom
C36  38.73,76.83 270 bottom
C37  45.72,81.6 270 bottom
C38  42.55,82.55 180 bottom
C39  41.91,80.33 0 bottom
C40  95.88,130.81 180 top
C41  104.77,48.89 180 top
C42  87.95,75.56 180 top
C43  120.02,127.63 0 top
C44  114.94,127.63 180 top
C45  100.33,46.99 180 top
C46  95.25,46.99 0 top
C47  104.14,127.63 0 top
C48  109.22,127.63 180 top
C49  93.34,50.8 90 top
C50  93.34,55.88 270 top
C51  105.41,66.04 180 top
C62  100.97,118.11 270 top
C63  103.82,118.11 270 top
C64  106.05,118.11 270 top
C65  103.5,107.95 270 top
C66  101.28,107.95 270 top
C67  121.92,116.2 0 top
C68  125.73,118.11 90 top
C69  112.39,107.95 90 top
C70  110.17,107.95 90 top
C71  116.84,107.95 270 top
C72  114.62,107.95 270 top
C73  121.29,107.95 270 top
C74  119.06,107.95 270 top
C75  105.73,107.95 90 top
C76  107.95,107.95 90 top
ENCODER  98.42,43.81 0 top
IC1  85.72,67.31 0 top
IC2  94.61,125.09 180 top
IC3  104.77,59.05 90 top
IC4  113.03,118.11 270 bottom
IIC_TDA  97.16,63.94 180 top
IN-L  102.23,149.86 0 top
IN-R  120.02,149.86 0 top
J1  84.45,74.3 270 top
J5  95.25,108.59 0 bottom
JP1  67.31,18.41 0 top
JP2  47.62,18.41 0 top
JP3  29.85,105.41 180 top
JP4  62.23,50.16 270 top
JP5  105.41,29.21 0 top
JP6  117.48,131.44 180 top
JP7  106.68,131.44 180 top
JP8  96.52,114.94 270 top
JP9  111.12,140.34 180 top
JP10  49.53,140.97 180 top
JP11  114.3,66.04 270 top
L5  17.14,120.65 180 top
L6  49.53,120.65 0 top
OUT-L  15.24,149.86 0 top
OUT-R  83.82,149.86 0 top
Q1  89.53,84.45 180 top
Q2  121.92,34.92 180 top
R1  8.89,88.27 180 bottom
R2  8.89,59.69 0 bottom
R3  37.78,67.94 0 bottom
R4  87.4,58.9 0 top
R5  34.29,72.39 0 bottom
R6  34.92,55.25 90 top
R7  32.07,55.25 90 top
R8  46.36,55.25 90 top
R9  43.5,55.25 90 top
R10  20,95.57 90 top
R11  41.59,95.57 270 top
R12  22.86,104.14 270 top
R13  37.15,104.14 90 top
R17  103.5,51.44 0 top
R18  97.16,56.52 270 top
R19  111.12,45.08 0 top
R20  96.52,26.03 180 top
R21  117.48,43.81 90 top
R22  116.2,48.26 180 top
R23  113.03,50.8 180 top
R24  122.87,38.89 180 top
R25  90.17,34.92 270 top
R26  98.42,51.44 0 top
R28  92.72,70.1 0 top
R29  114.3,104.78 0 top
R30  109.86,104.78 0 top
R31  120.65,104.78 180 top
R32  104.77,104.78 180 top
R33  93.98,118.75 0 top
R34  27.31,70.48 0 top
RN1  95.88,67.31 0 top
U$1  12.07,67.94 180 bottom
U$2  12.07,79.38 180 bottom
U$3  38.1,79.38 180 top
U$5  [HEATSINK_65_42]  38.1,79.38 270 top
U$6  93.34,77.47 180 top
U$7  111.12,87 180 top
U$8  113.66,38.1 0 top
X4  47.62,0.63 90 top
X5  5.08,76.83 90 top
X6  67.31,0.63 90 top
Z1  42.55,67.94 180 bottom

### Tracks (layer width: path | path; a pad name or v marks a point on that pad's centre or on a via)
+5V
  Top 0.305: R20.2 90.17,26.03 88.9,27.3 JP5.2 88.9,33.02 R25.E 88.9,33.27 88.9,34.92 90.17,36.19 90.17,38.73 | 106.05,57.15 106.05,54.83 IC3.6 105.97,53.43 105.57,53.02 104.77,53.02 | 106.05,57.15 106.77,57.88 IC3.18 106.77,65.62 C51.1 | IC3.4 104.38,53.42 104.77,53.02 | 104.77,53.02 104.77,51.59 R17.2 105.72,50.64 C41.1 106.05,48.58 106.05,43.18 101.6,38.73 90.17,38.73 | C51.1 106.36,65.72 105.41,64.77 105.25,64.61 105.25,63.02 | IC3.20 105.17,58.02 106.05,57.15 | 84.41,59.05 C3.+ 83.82,61.47 IC1.1 | 84.41,59.05 84.41,44.49 90.17,38.73 | JP11.2 110.17,69.85 C51.1 | R4.1 84.57,58.9 84.41,59.05
CREF
  Top 0.406: C62.+ 102.36,121.01 IC4.2
D_B0
  Top 0.305: U$8.15 112.04,37.75 110.49,36.19 107.31,33.02 104.77,33.02 102.23,30.48 102.23,29.84 JP5.7
D_B1
  Top 0.305: U$8.1 111.39,34.55 109.22,32.38 106.05,32.38 104.14,30.48 JP5.8
D_B2
  Top 0.305: U$8.2 112.04,33.94 109.86,31.75 108.58,31.75 106.68,29.84 JP5.9
D_B3
  Top 0.305: U$8.3 112.69,33.31 110.49,31.11 109.86,31.11 109.22,30.48 JP5.10
D_B4
  Top 0.305: U$8.4 113.34,32.69 111.76,31.11 JP5.11
D_B5
  Top 0.305: U$8.5 113.99,29.52 JP5.12
D_B6
  Top 0.305: U$8.6 114.64,33.95 116.84,31.75 JP5.13
D_B7
  Top 0.305: U$8.7 115.29,34.57 119.38,30.48 JP5.14
D_BL+
  Top 0.305: JP5.15 Q2.3
D_BL_PWM
  Top 0.305: R23.2 111.76,50.95 111.76,53.97 111.76,59.69 111.19,60.25 IC3.14
D_E
  Top 0.305: JP5.6 99.06,31.75 107.95,40.64 107.95,46.99 107.95,47.62 110.25,49.93 110.25,54.38 111.12,55.25 111.12,59.05 110.72,59.45 IC3.13
D_RS
  Top 0.305: JP5.4 93.98,31.11 94.61,31.75 95.25,32.38 98.42,32.38 107.16,41.12 107.16,46.83 107.16,48.74 109.45,51.03 109.45,54.84 110.49,55.88 110.49,58.42 110.25,58.66 IC3.12
D_V0
  Top 0.305: 91.44,32.77 91.44,32.38 | 91.44,32.38 JP5.3 | R25.S 90.42,35.31 91.44,34.29 91.44,32.38
DGND
  Top 0.305: JP5.1 86.36,25.4 87.63,24.13 95.88,24.13 96.52,24.77 | 96.52,24.77 JP5.5 96.52,24.77 | 96.52,24.77 97.16,24.13 123.19,24.13 124.46,25.4 JP5.16 124.29,29.38 R24.1 | 104.14,56.52 103.58,55.95 IC3.3 103.58,49.78 C41.2 103.5,48.58 103.5,41.91 102.87,41.27 99.06,41.27 | IC3.5 105.17,56.11 104.77,56.52 104.14,56.52 | 104.14,56.52 104.38,56.75 IC3.21 104.46,63.43 C51.2 104.46,67 104.77,67.31 109.86,72.39 JP11.1 | JP5.1 86.36,34.35 R25.A | C49.2 93.34,53.97 | 93.34,53.97 C50.2 | 99.06,41.27 98.42,41.91 ENCODER.2 98.42,46.99 | 88.9,53.97 BUTTON.2 93.34,53.97 | 88.9,53.97 86.99,53.97 86.99,43.18 88.9,41.27 99.06,41.27 | 88.9,53.97 87.41,54.01 C3.- 86.36,61.93 IC1.3 86.36,66.67 85.72,67.31 | IC1.2 85.09,66.67 84.45,67.31 | 84.45,67.31 83.19,67.31 82.55,66.67 82.55,33.02 JP5.1 | IC1.7 85.09,67.94 84.45,67.31 | 85.72,67.31 86.36,67.94 IC1.6 86.36,71.75 86.99,72.39 86.99,74.93 86.68,75.25 | 85.72,67.31 84.45,67.31 | J1.2 86.36,75.56 | 86.36,75.56 86.68,75.25 | U$6.4 91.44,78.74 90.8,78.11 | 90.8,78.11 88.9,78.11 86.36,75.56 | C42.2 86.68,75.25 | U$7.- 125.73,79.38 123.83,77.47 91.44,77.47 90.8,78.11 | C46.2 98.42,46.99 | 98.42,46.99 C45.2
  pour Top (isolate 0.61): 81.28,25.4 81.28,93.98 84.45,97.16 125.73,97.16 128.27,94.62 128.27,25.4 125.73,22.86 83.82,22.86
GND  (via drill 0.5 pad 1.02, 0.5 pad 1.27)
  Top 0.305: v32.39,52.07 32.07,52.39 | 29.85,98.1 C24.1 21.59,99.06 17.78,99.06 16.51,100.33 C28.1 C30.2 16.06,104.59 C26.1 | 29.85,98.1 C25.2 39.05,98.74 40,99.69 41.91,99.69 42.55,100.33 C29.2 C31.1 42.54,105.59 C27.2 | JP3.2 29.85,98.1
  Top 0.406: R34.1 25.4,70.48
  Top 0.813: v20.96,80.64 19.05,78.74 v15.88,75.56
  Top 1.016: R9.1 43.5,52.39 v43.18,52.07 | 32.07,52.39 R7.1 | v32.39,52.07 29.85,49.53 24.77,49.53 22.22,52.07 22.22,69.22 v15.88,75.56 24.07,75.56
  Top 1.27: v29.85,97.79 29.85,98.1
  Bottom 0.813: C10.1 36.45,78.23 C36.1 40.7,78.23 C34.2 43.31,79.95 C39.1 45.59,80.33 C37.2 46.17,80.2 47.62,78.74 47.62,71.62 46.36,70.48 C8.1 43.95,68.25 Z1.A | C10.1 C12.2 | C10.1 34.8,79.63 C15.1 33.97,80.52 C13.2 22.36,80.52 v20.96,80.64 | v15.88,75.56 C4.-
  Bottom 1.016: v43.18,52.07 37.47,52.07 v32.39,52.07
  Bottom 1.27: R2.2 6.98,59.69 C2.+ | C7.1 6.98,55.88 C2.+ | R1.1 6.98,88.27 C1.- | C1.- 6.98,92.08 C6.2 7.49,94.48 8.89,95.88 29.85,95.88 v29.85,97.79 | C4.- 6.35,75.56 | 6.35,75.56 X5.2 7.57,71.75 C5.+ | 6.35,75.56 5.08,74.3 2.54,74.3 2.22,74.61 | 2.22,74.61 1.91,74.93 1.91,88.27 3.81,90.17 C1.- | C2.+ 3.18,57.78 1.91,59.05 1.91,74.3 2.22,74.61
  pour Top (isolate 0.61): 63.5,133.98 66.04,131.44 66.04,38.1 63.5,35.56 2.54,35.56 0,38.1 0,131.44 2.54,133.98
  pour Bottom (isolate 0.61): 63.5,133.98 66.04,131.44 66.04,38.1 63.5,35.56 2.54,35.56 0,38.1 0,131.44 2.54,133.98
MEGA_RESET  (via drill 0.5 pad 1.27)
  Top 0.305: IC3.29 97.87,58.66 R18.1 97,57.78 95.88,57.78 93.98,59.69 v92.08,59.69 | JP11.3 v110.49,67.31
  Bottom 0.305: v110.49,67.31 102.87,59.69 v92.08,59.69
N$1
  Top 0.406: IC4.11 118.52,123.46 C43.+
N$2
  Top 0.305: C18.2 R8.2
N$3
  Top 0.305: U$3.4 40.6,64.94 C21.1 46.17,61.91 C18.1
N$4
  Top 0.406: IC4.10 116.43,123.46 C44.+
N$5
  Top 0.305: R9.2 43.5,58.61 C19.2
N$6
  Top 0.305: U$3.5 39.6,63.14 C21.2
  Top 0.406: C21.2 C19.1
N$7
  Top 0.305: IC1.8 83.82,72.39 J1.1
N$8
  Top 0.305: C16.2 R6.2
N$9
  Top 0.305: U$3.8 36.6,63.4 C16.1 34.74,61.91 C20.1
N$10
  Bottom 0.406: 45.08,5.71 45.34,5.71
  Bottom 0.813: JP2.1 40.64,12.7 40.64,7.62 42.55,5.71 45.08,5.71 | 45.34,5.71 X4.1
N$11
  Top 0.305: C17.2 31.88,56.38 R7.2
N$12
  Top 0.305: U$3.9 35.6,68.43 35.6,66.72 34.92,66.04 30.48,66.04 29.21,64.77 29.21,62.23 C20.2 C17.1
N$13
  Top 0.305: U$3.15 34.6,90.65 33.5,91.76 C22.2
N$14  (via drill 0.5 pad 1.02)
  Top 0.305: U$3.18 37.6,88.4 v38.73,89.53
  Bottom 0.305: v38.73,89.53 37.47,88.27 37.47,84.45 39.05,82.87 C32.1
N$15  (via drill 0.5 pad 1.02)
  Top 0.406: U$3.13 32.6,88.05 v32.39,88.27
  Bottom 0.406: v32.39,88.27 32.39,86.05 C33.1
N$16
  Top 0.305: U$3.22 41.6,91.75 C23.2
N$17  (via drill 0.5 pad 1.02)
  Top 0.305: U$3.7 37.6,66.17 v37.78,66.04
  Bottom 0.305: C9.1 | R5.1 35.24,69.53 34.92,69.22 33.02,69.22 32.39,68.58 32.39,66.67 33.02,66.04 v37.78,66.04
  Bottom 0.813: C9.1 R5.1
N$18
  Top 0.305: U$3.21 40.6,89.58 39.69,90.49 C23.1 39.69,92.24 R11.2 48.43,94.15 60.33,106.04 60.33,120.55 L6.P$4
N$19
  Top 0.305: 20.64,93.51 20.56,93.59 | 20.56,93.59 R10.1 18.25,94.15 6.35,106.04 6.35,120.55 L5.P$4 | U$3.16 35.6,91.4 33.34,93.66 C22.1 20.64,93.66 20.56,93.59
N$20
  Top 0.305: R11.1 41.44,96.84 40.81,96.2 C25.1
N$21
  Top 0.305: R10.2 20.16,96.84 20.79,96.2 C24.2
N$22
  Top 0.406: C43.- 120.02,129.13 JP6.1
N$23
  Top 0.305: C28.2 22.6,101.6 R12.2
N$24
  Top 0.305: U$6.2 93.98,81.91 93.34,82.55 92.08,82.55 Q1.4
N$25
  Top 0.305: U$6.1 95.25,82.42 95.25,82.55 92.71,85.09 92.33,85.47 Q1.1
N$26
  Top 0.305: C31.2 40.64,106.5 C27.1 37.41,106.68 R13.2 | L6.P$2 38.83,108.63 R13.2 | R13.2 33.92,106.94 JP3.1
N$27
  Top 0.305: C29.1 37.41,101.6 R13.1
N$28
  Bottom 0.813: X4.2 45.08,10.79 JP2.2
N$29  (via drill 0.5 pad 1.02)
  Top 0.305: U$3.6 38.6,69.98 v38.58,69.85
  Bottom 0.305: v38.58,69.85 38.73,69.85 R3.1
  Bottom 0.813: C8.2 40.84,70.19 Z1.C R3.1
N$30
  Top 0.305: U$6.3 92.71,78.74 93.34,78.11 95.88,78.11 96.52,78.74 U$7.+
N$31
  Top 0.406: C44.- 114.94,129.13 JP6.3
N$32
  Top 1.27: JP4.3 41.59,47.62 R6.1
N$33
  Bottom 0.813: X4.3 47.62,10.63 JP2.3
N$34
  Bottom 0.406: X4.4 50.17,8.38
  Bottom 0.813: 50.17,8.38 JP2.4
N$35
  Bottom 0.406: X4.5 52.7,8.45
  Bottom 0.813: 52.7,8.45 JP2.5
N$36
  Bottom 0.813: JP1.1 60.33,10.16 60.33,7.62 62.23,5.71 64.77,5.71 65.03,5.71 X6.1
N$37
  Bottom 0.406: 67.31,13.34 JP1.2
  Bottom 0.813: X6.2 67.31,13.34
N$38
  Bottom 0.813: JP1.3 72.51,11.95 X6.5
N$39
  Top 0.406: C48.+ 109.22,129.13 JP7.1
N$40
  Top 0.305: R12.1 25.78,106.94 JP3.3 | L5.P$2 27.84,111.92 27.84,109.12 27.31,108.59 24.13,108.59 22.86,107.31 R12.1 | R12.1 22.6,106.68 C26.2 18.41,106.23 C30.1
N$41
  Top 0.406: C47.+ 104.14,129.13 JP7.3
N$42
  Top 0.406: IC4.6 109.47,125.88 C48.-
N$43
  Top 0.406: IC4.5 107.7,124.71 106.68,125.73 105.64,126.77 C47.-
N$44
  Bottom 1.016: JP9.3 107.26,140.34 IN-L.1
N$45
  Bottom 1.016: JP9.1 114.99,140.34 IN-R.1
N$46
  Top 0.406: JP8.2 99.83,113.66 IC4.30
N$47
  Top 0.406: IC4.1 98.42,121.15 98.42,120.01 98.42,118.11 JP8.1
N$48
  Top 0.406: IC4.3 104.14,125.09 103.5,125.73 101.6,125.73 97.79,129.54 C40.+ 96.52,130.58 IC2.1
N$49
  Top 0.406: R33.2 96.52,119.86 IC2.8
N$50
  Bottom 0.406: 101.15,149.86 IN-L.2@2
  Bottom 1.016: IN-L.2@1 101.15,149.86 IN-L.2@2 103.32,149.86 IN-L.2 111.12,142.06 | IN-R.2 121.1,149.86 IN-R.2@2 118.93,149.86 IN-R.2@1 111.12,142.06 | 111.12,142.06 JP9.2 111.12,142.06
N$51
  Bottom 1.016: OUT-L.2@1 14.15,149.86 OUT-L.2@2 16.33,149.86 OUT-L.2 45.78,145.36 49.53,141.6 | 49.53,141.6 JP10.2 | OUT-R.2 84.91,149.86 OUT-R.2@2 82.73,149.86 OUT-R.2@1 53.28,145.36 49.53,141.6
N$52
  Bottom 1.016: OUT-R.1 78.8,140.34 52.7,140.34 JP10.1
N$53
  Bottom 1.016: OUT-L.1 20.27,140.34 22.22,140.34 46.36,140.34 JP10.3
N$54
  Top 0.305: U$8.10 115.29,39.72 114.94,39.37 113.66,39.37 113.34,39.69 U$8.13 113.34,42.87 112.39,43.81 112.39,44.93 R19.2
N$55
  Top 0.305: R20.1 99.69,26.03 | 99.69,26.03 120.02,26.03 120.65,26.67 120.65,35.7 Q2.2 | 111.39,41.64 U$8.16 111.39,41.64 | 111.39,41.64 109.86,43.18 | 109.86,43.18 109.7,43.34 R19.1 | 111.39,41.64 109.86,43.18 | 109.86,43.18 109.86,40 100.33,30.48 100.33,26.67 99.69,26.03
N$57
  Top 0.305: R21.1 122.24,42.39 122.87,41.75 122.87,40.48 Q2.1
N$58
  Top 0.305: R21.2 117.48,47.47 R22.1
N$59
  Top 0.305: R23.1 114.45,48.59 R22.2
N$60
  Top 0.305: U$8.8 115.94,36.56 118.11,38.73 121.29,38.73 R24.2
N$61
  Top 0.305: R26.1 97,54.94 R18.2
N$62
  Top 0.305: R26.2 R17.1
N$63
  cutout Top: 88.27,74.3 128.27,74.3 128.27,74.93 88.27,74.93
N$64
  Top 0.305: U$6.5 91.3,74.73 R28.1
N$65
  Top 0.305: U$6.8 95.25,76.2 94.61,76.83 89.53,76.83 88.9,76.2 C42.1 | C42.1 88.9,67.31 | 88.9,67.31 88.9,59.54 88.77,59.41 R4.2 | C42.1 | RN1.1 88.9,67.31
N$66
  Top 0.254: 98.16,52.91 98.16,49.26
  Top 0.305: IC3.1 101.97,54.35 101.6,53.97 99.22,53.97 98.16,52.91 | 98.16,49.26 97.79,48.89 96.04,48.89 94.3,47.15 94.3,46.99 | 94.3,46.99 C46.1 | 94.3,46.99 94.3,45.4 ENCODER.1
N$67
  Top 0.254: 98.69,52.66 98.69,49.26
  Top 0.305: IC3.2 102.77,53.88 102.23,53.34 99.38,53.34 98.69,52.66 | 98.69,49.26 99.06,48.89 100.17,48.89 101.28,47.78 101.28,46.99 C45.1 101.73,44.58 ENCODER.3
N$68
  Top 0.254: 98.53,56.78 93.35,56.78
  Top 0.305: IC3.30 99.61,57.86 98.53,56.78 | C50.1 93.35,56.78 91.12,56.83 BUTTON.1
N$69
  Top 0.406: R33.1 92.56,110.01 J5.1
N$70
  Bottom 0.61: 43.81,53.97 43.81,54.61
N$71
  Top 0.254: 98.95,56.25 95.62,56.25
  Top 0.305: IC3.31 99.76,57.05 98.95,56.25 | 95.62,56.25 94.93,55.56 94.93,49.69 94.46,49.21 93.35,49.21 C49.1 92.2,49.4 BUTTON.3
N$72
  pour Bottom (isolate 0.61): 8.25,152.4 125.73,152.4 128.27,149.86 128.27,140.34 125.73,137.79 8.25,137.79 5.71,140.34 5.71,149.86
N$73
  pour Bottom (isolate 0.61): 28.57,1.91 28.57,15.24 30.48,17.14 83.19,17.14 85.09,15.24 85.09,1.91 83.19,0 30.48,0
N$74  (via drill 0.5 pad 1.02)
  other vias: 3.81,102.23
N$75  (via drill 0.5 pad 1.02)
  other vias: 48.3,104.99
N$76  (via drill 0.5 pad 1.02)
  other vias: 28.35,53.69
N$77  (via drill 0.5 pad 1.02)
  other vias: 62.23,40
N$78  (via drill 0.5 pad 1.02)
  other vias: 12.7,140.97
N$79  (via drill 0.5 pad 1.02)
  other vias: 121.92,140.97
N$80  (via drill 0.5 pad 1.02)
  other vias: 124.46,132.08
N$81  (via drill 0.5 pad 1.02)
  other vias: 93.34,103.5
N$82  (via drill 0.5 pad 1.02)
  other vias: 85.72,92.71
N$83  (via drill 0.5 pad 1.02)
  other vias: 124.46,61.59
N$84  (via drill 0.5 pad 1.02)
  other vias: 85.09,38.73
N$85  (via drill 0.5 pad 1.02)
  other vias: 81.91,10.79
N$86  (via drill 0.5 pad 1.02)
  other vias: 31.11,10.79
N$90
  Top 0.406: C66.1 C65.1 103.5,109.85 104.77,111.12 105.92,112.27 IC4.27
N$92
  Top 0.406: C64.2 C63.2 104.14,116.84 IC4.28
N$93
  Top 0.406: C68.+ 125.48,116.36 IC4.16
N$94
  Top 0.406: C68.- 125.48,119.86 IC4.15
N$95
  Top 0.406: IC4.18 121.92,114.7 C67.+
N$96
  Top 0.406: IC4.17 123.42,113.19 C67.-
N$97
  Top 0.406: C69.2 112.39,111.12 113.03,111.76 IC4.23
N$98
  Top 0.406: C70.2 110.17,110.81 111.12,111.76 111.25,111.89 IC4.24
N$99
  Top 0.406: C71.1 116.84,111.76 116.59,112.01 IC4.21
N$100
  Top 0.406: C72.1 114.62,111.44 114.94,111.76 114.81,111.89 IC4.22
N$101
  Top 0.406: C71.2 C72.2 114.62,105.41 R29.2
N$102
  Top 0.406: R30.1 108.91,105.73 C70.1 C69.1
N$103
  Top 0.406: C73.1 121.29,110.49 120.65,111.12 120.14,111.63 IC4.19
N$104
  Top 0.406: C74.1 119.06,111.44 118.74,111.76 118.36,112.14 IC4.20
N$105
  Top 0.406: C75.2 105.73,110.17 107.31,111.76 107.7,112.14 IC4.26
N$106
  Top 0.406: C76.2 107.95,110.49 109.22,111.76 109.47,112.01 IC4.25
N$107
  Top 0.406: R31.2 119.23,106.83 C74.2 C73.2
N$108
  Top 0.406: R32.1 105.73,105.24 C75.1 C76.1
RIGHT_AMP
  Top 1.27: JP4.1 47.95,52.7 R8.1
SCL
  Top 0.305: IC3.28 96.12,59.45 92.86,62.71 92.86,66.83 RN1.2 93.34,67.94 92.71,68.58 U$6.6
SCL_TDA
  Top 0.305: IC3.26 97.06,61.05 95.88,62.23 IIC_TDA.2 95.88,64.77 RN1.4
SDA
  Top 0.305: IC3.27 96.59,60.25 94.61,62.23 94.61,64.92 94.61,66.04 RN1.3 95.88,68.36 R28.2
SDA_TDA
  Top 0.305: IC3.25 98.8,61.86 98.42,62.23 IIC_TDA.1 98.42,64.77 RN1.5
SGND  (via drill 0.5 pad 1.02)
  Top 0.305: U$3.11 33.6,71.06 33.02,70.48 v31.11,70.48 | v45.72,66.04 42.6,69.16 U$3.2
  Top 0.406: R34.2 v31.11,70.48
  Top 0.61: JP4.2 42.55,50.16 38.1,54.61 v38.1,62.23
  Bottom 0.305: v31.11,70.48 31.11,65.41 31.75,64.77 38.1,64.77 44.45,64.77 v45.72,66.04
  Bottom 0.61: v38.1,62.23 38.1,64.77
SQW
  Top 0.305: IC3.32 101.34,56.25 102.23,57.15 102.23,61.59 100.97,62.86 100.97,64.77 102.87,66.67 102.87,69.22 100.97,71.12 100.33,71.75 94.61,71.75 93.98,72.39 U$6.7
SR_RCK
  Top 0.305: U$8.12 113.99,44.77 116.2,46.99 116.2,51.44 116.2,54.61 116.2,56.52 116.2,57.78 116.84,58.42 116.84,61.59 116.2,62.23 JP11.5 113.92,61.86 IC3.16
SR_SCK
  Top 0.305: U$8.11 114.64,42.25 116.2,43.81 118.74,43.81 119.38,44.45 119.38,49.53 119.38,56.52 119.38,61.59 116.2,64.77 JP11.4 109,64.77 IC3.17
SR_SI
  Top 0.305: U$8.14 112.69,42.25 111.12,43.81 111.12,46.99 113.03,48.89 113.03,56.52 113.03,59.69 | 113.03,59.69 113.03,60.33 112.39,60.96 109.16,60.96 IC3.15 | JP11.6 113.03,59.69
TDA_DGND
  Top 0.406: IC4.4 106.05,123.18 C64.1 C63.1 103.41,119.06 C62.- | C62.- 102.36,115.21 IC4.29 102.36,112.52 99.69,109.85 99.69,107.95 100.33,107.31 100.97,107.31 C66.2 C65.2 103.5,104.93 R32.2 103.35,103.66 104.14,102.87 111.76,102.87 | 111.76,102.87 121.29,102.87 121.92,103.5 121.92,104.62 R31.1 | R29.1 112.08,104.78 | 112.08,104.78 112.08,103.19 111.76,102.87 | 112.08,104.78 R30.2 | 93.98,130.81 C40.- 95.25,129.94 95.25,127.63 | 93.98,130.81 IC2.3 | IC2.3 93.98,127 | 93.98,127 IC2.3 | C62.- 100.73,116.61 99.06,114.94 94.61,114.94 93.98,115.57 93.98,111.76 | 93.98,111.76 93.98,120.01 | 93.98,120.01 IC2.6 93.98,125.09 | JP7.2 106.68,132.72 105.41,133.98 | 105.41,133.98 95.25,133.98 93.98,132.72 93.98,130.81 | 93.98,130.81 IC2.3 | IC2.3 93.98,127 | JP6.2 117.48,133.35 116.84,133.98 106.68,133.98 105.41,133.98 | 93.98,120.01 95.25,121.28 IC2.7 95.25,125.09 | 93.98,125.09 IC2.3 | IC2.2 95.25,127.63 | 95.25,127.63 95.25,125.09 | 95.25,127.63 95.25,125.09 | 95.25,125.09 93.98,125.09 | 93.98,111.76 94.61,111.12 96.52,109.22 J5.2
  pour Top (isolate 0.61): 92.08,135.25 125.73,135.25 127.64,133.35 127.64,102.87 125.73,100.97 92.08,100.97 90.8,102.23 90.8,133.98
VDDA  (via drill 0.5 pad 1.02)
  Top 0.305: v33.66,67.94 34.6,68.89 U$3.10 34.6,75.24 34.61,75.25 | 34.61,75.25 34.92,75.56 | U$3.3 41.6,75.24 41.28,75.56 34.92,75.56 | 34.92,75.56 34.61,75.25
  Top 0.406: v27.31,78.11 27.31,69.22 28.57,67.94 v33.66,67.94
  Bottom 0.305: v33.66,67.94 R3.2
  Bottom 0.406: 33.2,77.78 26.36,77.78 v27.31,78.11
  Bottom 0.813: C4.+ v27.31,78.11 30.79,78.11 C11.2 33.2,77.78 C10.2 | C35.1 41.47,75.44 C36.2 38.73,74.93 37.47,73.66 36.83,73.03 R3.2
  Bottom 1.27: U$2.P$2 12.13,78.17 C4.+
VDDP  (via drill 0.5 pad 1.02)
  Top 0.305: U$3.14 33.6,83.19 | 33.6,83.19 33.6,82.61 34.92,81.28 41.28,81.28 42.55,82.55 42.6,82.61 U$3.23 | v28.57,83.19 33.6,83.19
  Top 0.406: 42.6,82.61 47.57,82.61 v47.62,82.55
  Bottom 0.305: 33.15,83.31 28.71,83.31 v28.57,83.19
  Bottom 0.406: C38.2 45.27,82.55 C37.1
  Bottom 0.813: C14.2 33.15,83.31 C13.1 | C37.1 47.18,83 v47.62,82.55
  Bottom 1.27: C1.+ 12.7,87 X5.3 5.08,79.38 U$2.P$1 | C6.1 10.8,92.08 C1.+ | R1.2 10.8,88.27 C1.+ | C13.1 19.56,83.31 C1.+
VSSA  (via drill 0.5 pad 1.02)
  Top 0.305: U$3.1 44.7,72.77 v45.08,72.39 45.08,74.93 43.6,76.41 43.18,76.83 39.54,76.83 33.02,76.83 32.6,76.41 | U$3.12 32.6,76.41 | 32.6,76.41 31.11,74.93 v31.11,72.39
  Bottom 0.305: v45.08,72.39 45.08,73.97 C35.2 | v31.11,72.39 C11.1
  Bottom 0.813: C5.- 18.73,75.88 C11.1 33.2,75.88 C12.1 33.53,72.58 R5.2 C9.2 | C34.1 43.95,76.02 C35.2
  Bottom 1.27: C5.- 12.07,68.01 U$1.P$2
VSSP  (via drill 0.5 pad 1.02)
  Top 0.305: U$3.20 39.6,82.78 39.37,82.55 38.73,82.55 | 38.73,82.55 36.83,82.55 36.6,82.78 U$3.17 36.6,89.62 v36.67,89.69 | U$3.19 38.6,82.69 38.73,82.55 | U$3.24 43.6,88.05 v43.81,88.27
  Bottom 0.305: 36.2,83.5 36.67,83.98 v36.67,89.69 | v43.81,88.27 43.81,85.72
  Bottom 0.813: C38.1 41.59,81.41 C39.2 38.1,80.33 | C15.2 38.1,80.33 | 38.1,80.33 37.15,81.28 C32.2 36.2,83.5 C14.1 35.24,85.09 C33.2
  Bottom 1.27: X5.1 5.05,68.61 | 5.05,68.61 12.7,60.96 C2.- | C7.2 10.8,55.88 C2.- | R2.1 10.8,59.69 C2.- | U$1.P$1 5.71,67.94 5.05,68.61 | C2.- 18.41,57.78 24.77,57.78 48.26,57.78 49.53,59.05 49.53,83.19 46.99,85.72 43.81,85.72 41.91,85.72 41.28,85.09 41.28,82.87 C38.1